# EAGLE design pi_sainsmart_relay_4 (EAGLE 6.4)
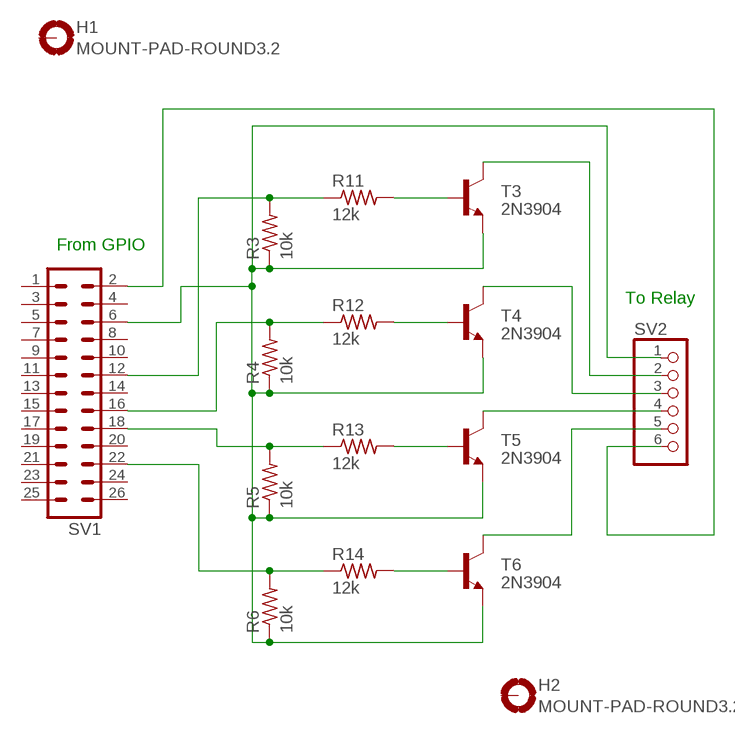
[diagram p0: schematic, sheet 1]

## Parts
H1  MOUNT-PAD-ROUND3.2  [3,2-PAD]
H2  MOUNT-PAD-ROUND3.2  [3,2-PAD]
R3  10k  R-US_0204/2V  [0204V]
R4  10k  R-US_0204/2V  [0204V]
R5  10k  R-US_0204/2V  [0204V]
R6  10k  R-US_0204/2V  [0204V]
R11  12k  R-US_0207/12  [0207/12]
R12  12k  R-US_0207/12  [0207/12]
R13  12k  R-US_0207/12  [0207/12]
R14  12k  R-US_0207/12  [0207/12]
SV1  MA13-2  [MA13-2]
SV2  PINHD-1X6  [1X06]
T3  2N3904  -NPN-TO92-EBC  [TO92-EBC]
T4  2N3904  -NPN-TO92-EBC  [TO92-EBC]
T5  2N3904  -NPN-TO92-EBC  [TO92-EBC]
T6  2N3904  -NPN-TO92-EBC  [TO92-EBC]

## Nets
GND: R3.1 R4.1 R5.1 R6.1 SV1.6 SV2.1 T3.E T4.E T5.E T6.E
N$1: SV1.2 SV2.6
N$3: R14.2 T6.B
N$4: R13.2 T5.B
N$5: R12.2 T4.B
N$6: R11.2 T3.B
N$13: SV2.2 T3.C
N$14: SV2.3 T4.C
N$15: SV2.4 T5.C
N$16: SV2.5 T6.C
N$20: R3.2 R11.1 SV1.12
N$21: R4.2 R12.1 SV1.16
N$22: R5.2 R13.1 SV1.18
N$23: R6.2 R14.1 SV1.22
Unconnected: H1.B3,2(MOUNT) H2.B3,2(MOUNT) SV1.1 SV1.3 SV1.4 SV1.5 SV1.7 SV1.8 SV1.9 SV1.10 SV1.11 SV1.13 SV1.14 SV1.15 SV1.17 SV1.19 SV1.20 SV1.21 SV1.23 SV1.24 SV1.25 SV1.26

## Notes on the sheet
- From GPIO
- To Relay

## Library data of the parts
H1 H2 = holes:MOUNT-PAD-ROUND: MOUNTING PAD, round
R3-R6 R11-R14 = resistor:R-US_: RESISTOR, American symbol
SV1 = con-lstb:MA13-2: PIN HEADER; OC_FARNELL: unknown; OC_NEWARK: unknown
SV2 = pinhead:PINHD-1X6: PIN HEADER
T3-T6 = transistor:*-NPN-: NPN Transistror BF959 corrected 2008.03.06

## Board
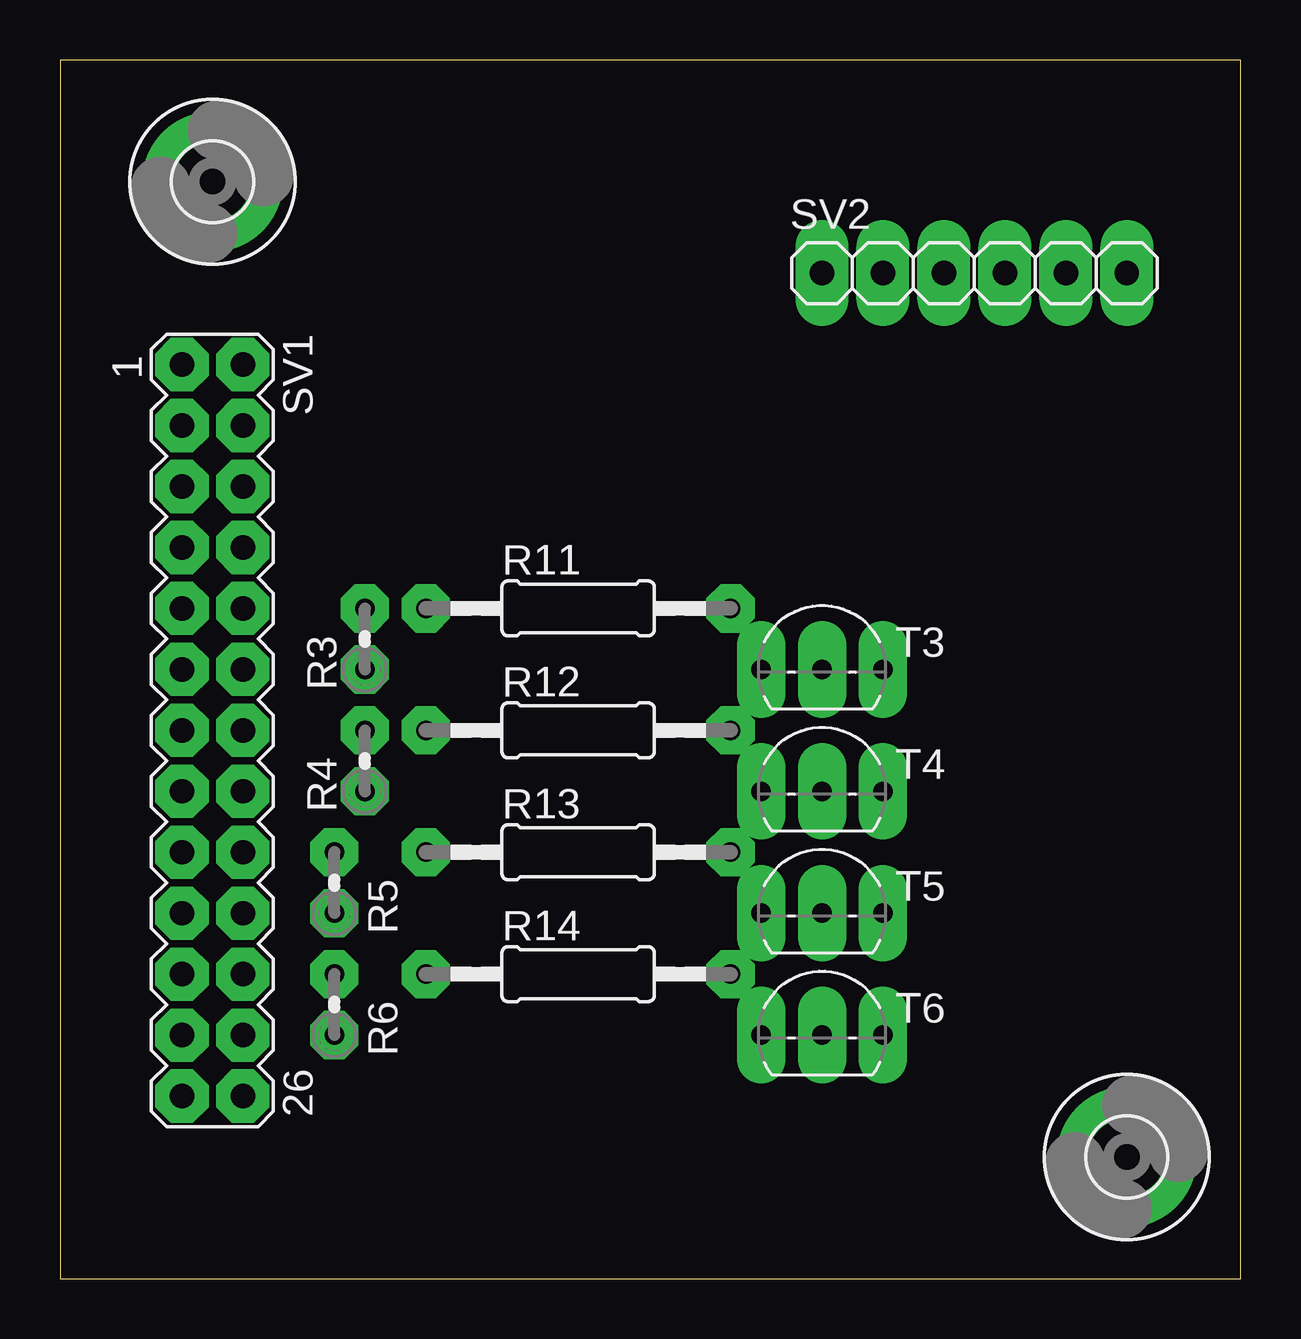
[diagram p1: board, top side]
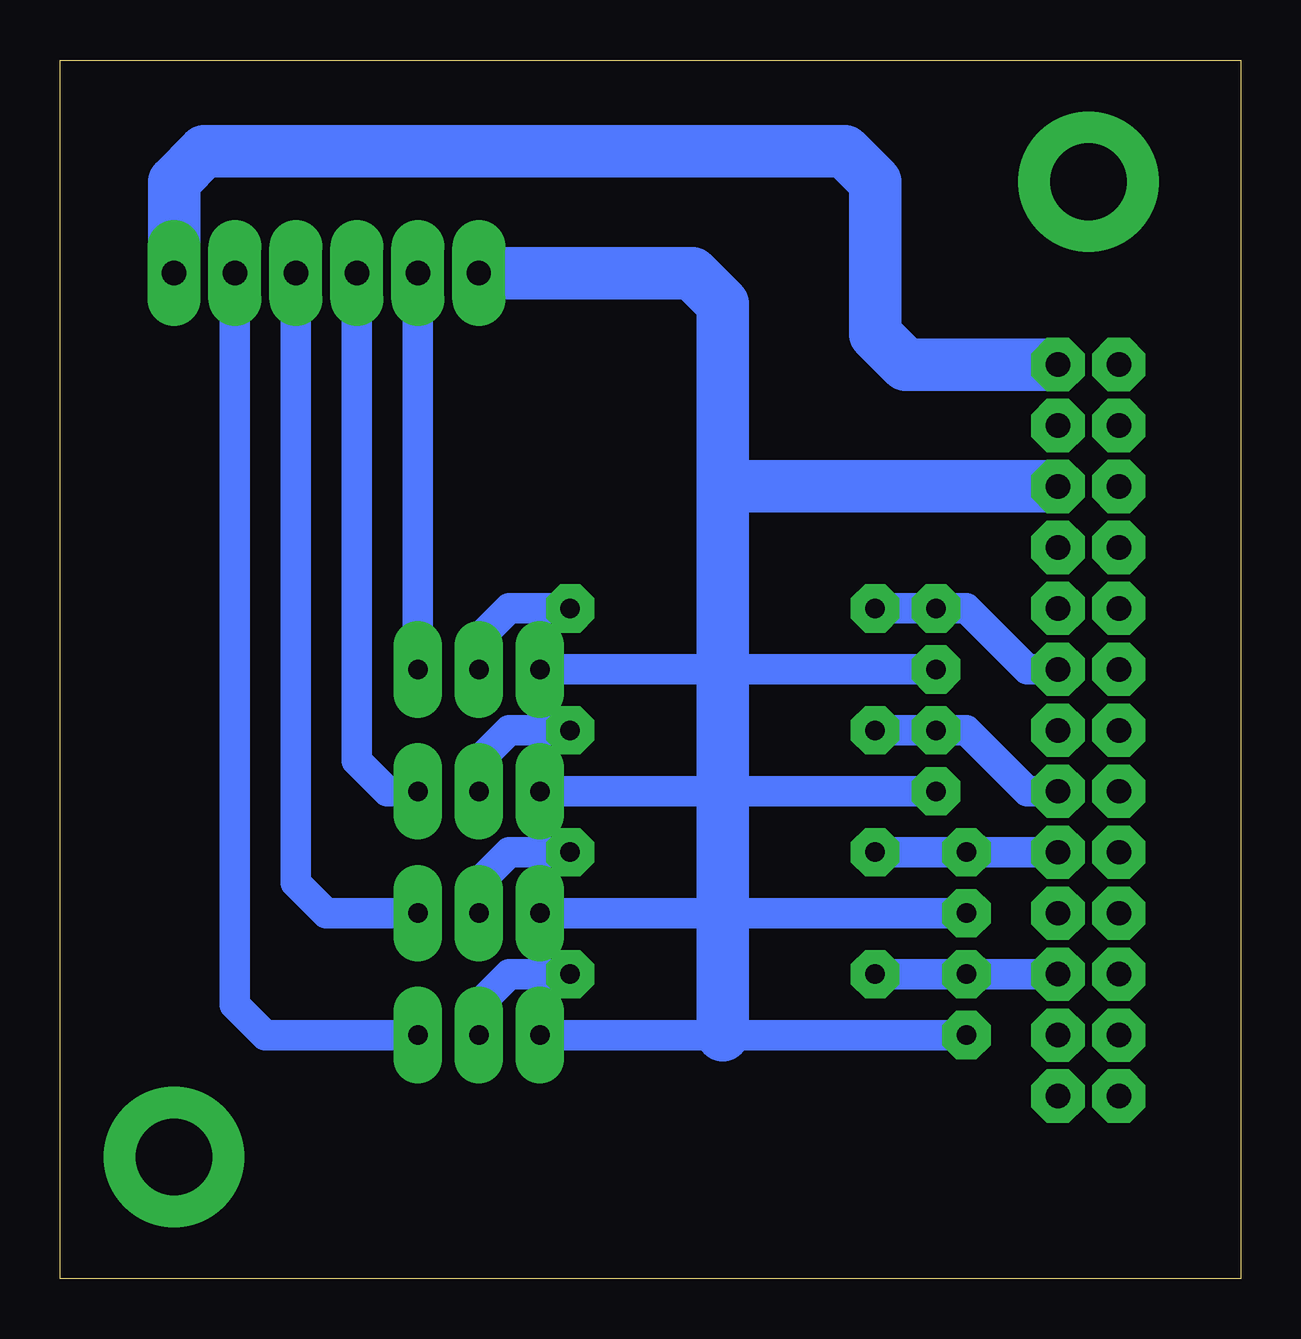
[diagram p2: board, bottom side, seen from below]

Size 49.2 x 50.79 mm. Coordinates in mm from the lower left corner, seen from the top.
Outline: 0,0 49.2,0 49.2,50.79 0,50.79 0,0
Copper layers (1*16): Top 0.035mm / dielectric 1.5mm / Bottom 0.035mm
Design rules "hobby": minimum track width 0.8mm, minimum drill 0.8mm, track to track 0.8mm, track to pad 0.8mm, pad to pad 0.45mm, via to via 0.8mm, smd to smd 8mil, copper to edge 10mil, drill to drill 8mil, minimum pad ring 0.6mm, minimum via ring 0.6mm, stop-mask expansion 0mil, vias tented up to drill 0mil, thermal gap 10mil

### Footprints (pad centres in the part's own frame; a part is rotated, then mirrored left to right if it is on the bottom)
3,2-PAD = drill 3.2 pad 5.842: B3,2 0,0
0204V = drill 0.813 octagon: 1 -1.27,0; 2 1.27,0
0207/12 = drill 0.813 octagon: 1 -6.35,0; 2 6.35,0
MA13-2 = drill 1.016 octagon: 1 -15.24,-1.27; 2 -15.24,1.27; 3 -12.7,-1.27; 4 -12.7,1.27; 5 -10.16,-1.27; 6 -10.16,1.27; 7 -7.62,-1.27; 8 -7.62,1.27; 9 -5.08,-1.27; 10 -5.08,1.27; 11 -2.54,-1.27; 12 -2.54,1.27; 13 0,-1.27; 14 0,1.27; 15 2.54,-1.27; 16 2.54,1.27; 17 5.08,-1.27; 18 5.08,1.27; 19 7.62,-1.27; 20 7.62,1.27; 21 10.16,-1.27; 22 10.16,1.27; 23 12.7,-1.27; 24 12.7,1.27; 25 15.24,-1.27; 26 15.24,1.27
1X06 = drill 1.016 long: 1 -6.35,0; 2 -3.81,0; 3 -1.27,0; 4 1.27,0; 5 3.81,0; 6 6.35,0
TO92-EBC = drill 0.813 long: B 0,-1.27; C 2.54,-1.27; E -2.54,-1.27

### Placement (x,y rotation side)
H1  6.35,45.72 0 top
H2  44.45,5.08 0 top
R3  12.7,26.67 90 top
R4  12.7,21.59 90 top
R5  11.43,16.51 90 top
R6  11.43,11.43 90 top
R11  21.59,27.94 0 top
R12  21.59,22.86 0 top
R13  21.59,17.78 0 top
R14  21.59,12.7 0 top
SV1  6.35,22.86 270 top
SV2  38.1,41.91 0 top
T3  31.75,26.67 0 top
T4  31.75,21.59 0 top
T5  31.75,16.51 0 top
T6  31.75,11.43 0 top

### Tracks (layer width: path | path; a pad name or v marks a point on that pad's centre or on a via)
GND
  Bottom 1.27: T4.E 21.59,20.32 R4.1 | T6.E 21.59,10.16 R6.1 | R3.1 21.59,25.4 T3.E | R5.1 21.59,15.24 T5.E
  Bottom 2.184: SV2.1 22.86,41.91 21.59,40.64 21.59,33.02 | 21.59,33.02 SV1.6 | 21.59,33.02 21.59,25.4 21.59,20.32 21.59,15.24 21.59,10.16
N$1
  Bottom 2.184: SV1.2 13.97,38.1 15.24,39.37 15.24,45.72 16.51,46.99 43.18,46.99 44.45,45.72 SV2.6
N$3
  Bottom 1.27: T6.B 31.75,11.43 30.48,12.7 R14.2
N$4
  Bottom 1.27: T5.B 31.75,16.51 30.48,17.78 R13.2
N$5
  Bottom 1.27: T4.B 31.75,21.59 30.48,22.86 R12.2
N$6
  Bottom 1.27: T3.B 31.75,26.67 30.48,27.94 R11.2
N$13
  Bottom 1.27: SV2.2 T3.C
N$14
  Bottom 1.27: T4.C 35.56,20.32 36.83,21.59 SV2.3
N$15
  Bottom 1.27: T5.C 38.1,15.24 39.37,16.51 SV2.4
N$16
  Bottom 1.27: T6.C 40.64,10.16 41.91,11.43 SV2.5
N$20
  Bottom 1.27: R11.1 R3.2 11.43,27.94 8.89,25.4 SV1.12
N$21
  Bottom 1.27: R12.1 R4.2 11.43,22.86 8.89,20.32 SV1.16
N$22
  Bottom 1.27: SV1.18 R5.2 R13.1
N$23
  Bottom 1.27: R14.1 R6.2 SV1.22